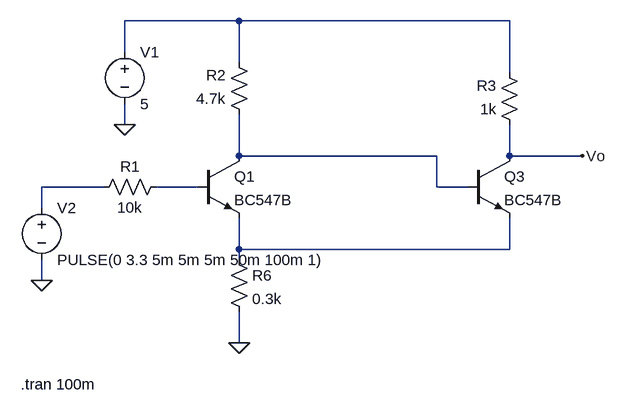
[diagram p0: schematic tr_schmitt_trigger.asc]
tr_schmitt_trigger.asc, the LTspice schematic file:
Version 4
SHEET 1 892 680
WIRE 320 64 144 64
WIRE 736 64 320 64
WIRE 144 112 144 64
WIRE 320 128 320 64
WIRE 736 144 736 64
WIRE 144 224 144 192
WIRE 320 272 320 208
WIRE 624 272 320 272
WIRE 736 272 736 224
WIRE 848 272 736 272
WIRE 112 320 16 320
WIRE 256 320 192 320
WIRE 624 320 624 272
WIRE 672 320 624 320
WIRE 16 352 16 320
WIRE 320 416 320 368
WIRE 736 416 736 368
WIRE 736 416 320 416
WIRE 320 432 320 416
WIRE 16 464 16 432
WIRE 320 560 320 512
FLAG 320 560 0
FLAG 144 224 0
FLAG 848 272 Vo
FLAG 16 464 0
SYMBOL npn 256 272 R0
SYMATTR InstName Q1
SYMATTR Value BC547B
SYMBOL npn 672 272 R0
SYMATTR InstName Q3
SYMATTR Value BC547B
SYMBOL Res 208 304 R90
WINDOW 0 0 56 VBottom 2
WINDOW 3 32 56 VTop 2
SYMATTR InstName R1
SYMATTR Value 10k
SYMBOL Res 336 224 R180
WINDOW 0 36 76 Left 2
WINDOW 3 36 40 Left 2
SYMATTR InstName R2
SYMATTR Value 4.7k
SYMBOL Res 752 240 R180
WINDOW 0 36 76 Left 2
WINDOW 3 36 40 Left 2
SYMATTR InstName R3
SYMATTR Value 1k
SYMBOL Res 304 416 R0
SYMATTR InstName R6
SYMATTR Value 0.3k
SYMBOL Voltage 144 96 R0
SYMATTR InstName V1
SYMATTR Value 5
SYMBOL Voltage 16 336 R0
SYMATTR InstName V2
SYMATTR Value PULSE(0 3.3 5m 5m 5m 50m 100m 1)
TEXT -16 624 Left 2 !.tran 100m

The netlist it stands for:
* tr_schmitt_trigger.asc
Q1 N002 N004 N005 0 BC547B
Q3 Vo N002 N005 0 BC547B
R1 N004 N003 10k
R2 N002 N001 4.7k
R3 Vo N001 1k
R6 N005 0 0.3k
V1 N001 0 5
V2 N003 0 PULSE(0 3.3 5m 5m 5m 50m 100m 1)
.model NPN NPN
.model PNP PNP
.lib standard.bjt
.tran 100m
.backanno
.end